# EAGLE design Desktop_Basic (EAGLE 9.4.2)
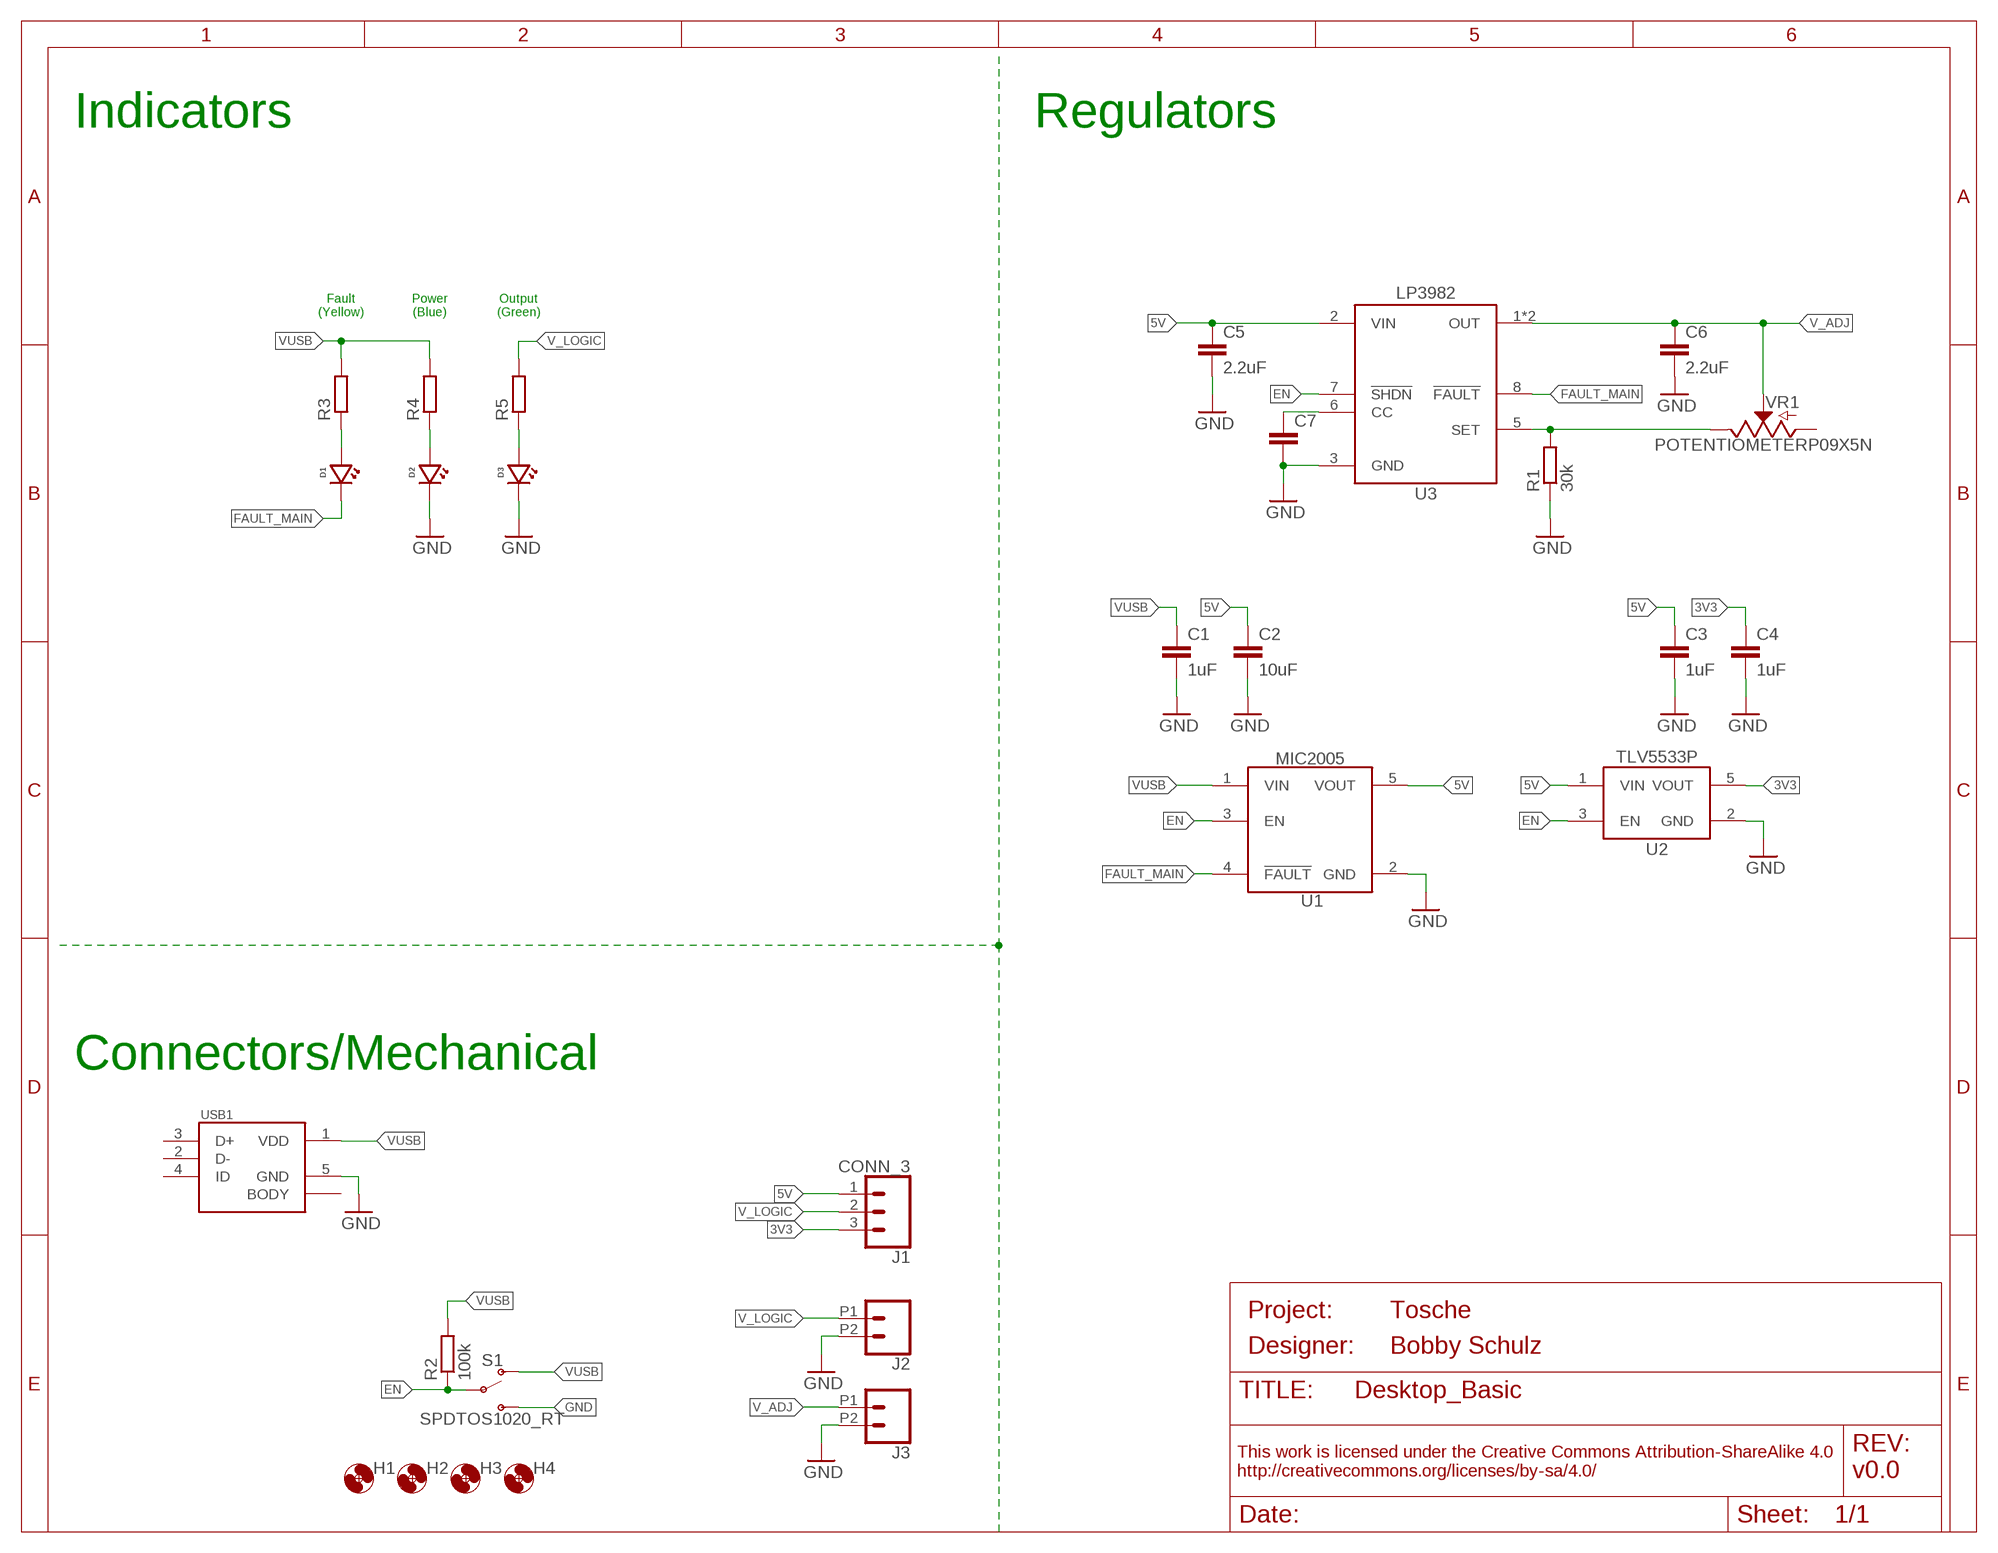
[diagram p0: schematic, sheet 1]
FRAME1 (FRAME_A_L): DESIGNER: Bobby Schulz; PROJECT: Tosche; REV: v0.0

## Parts
C1  1uF  C-EU1UFC0603  [C0603]
C2  10uF  C-EU10UFC0805  [C0805]
C3  1uF  C-EU1UFC0603  [C0603]
C4  1uF  C-EU1UFC0603  [C0603]
C5  2.2uF  C-EU2.2UFC0603  [C0603]
C6  2.2uF  C-EU2.2UFC0603  [C0603]
C7  C-EUC0603  [C0603]
D1  LED0603  [LED_0603]
D2  LEDBLUE0603  [LED_0603]
D3  LEDGREEN0603  [LED_0603]
H1  MOUNTING_HOLE4_PL  [4_40_PLATED]
H2  MOUNTING_HOLE4_PL  [4_40_PLATED]
H3  MOUNTING_HOLE4_PL  [4_40_PLATED]
H4  MOUNTING_HOLE4_PL  [4_40_PLATED]
J1  CONN_3  [1X03]
J2  CONN_022.54_SCREW_ROUND  [1X02_2.54_SCREWTERM_ROUND]
J3  CONN_022.54_SCREW_ROUND  [1X02_2.54_SCREWTERM_ROUND]
R1  30k  R-EU_R0603  [R0603]
R2  100k  R-EU_100KR0603  [R0603]
R3  R-EU_330R0603  [R0603]
R4  R-EU_330R0603  [R0603]
R5  R-EU_330R0603  [R0603]
S1  SPDTOS1020_RT  [OS102011MA1QN1]
U1  MIC2005  [SOT23-5]
U2  TLV755P3V3SOT23  [DBV0005A]
U3  LP3982ADJVSSOP  [DGK_S-PDSO-G8]
USB1  MICRO_USB_LONGPADS  [10118194-0001LF_10118194-0001LF_LONGER_PADS]
VR1  POTENTIOMETERP09X5N  [P0915N]

## Nets
3V3: C4.1 J1.3 U2.5(VOUT)
5V: C2.1 C3.1 C5.1 J1.1 U1.5(VOUT) U2.1(VIN) U3.2(VIN)
EN: R2.1 S1.2(P) U1.3(EN) U2.3(EN) U3.7(!SHDN)
FAULT_MAIN: D1.CATHODE U1.4(!FAULT) U3.8(!FAULT)
GND: C1.2 C2.2 C3.2 C4.2 C5.2 C6.2 C7.2 D2.CATHODE D3.CATHODE J2.P2 J3.P2 R1.1 S1.3(S) U1.2(GND) U2.2(GND) U3.3(GND) USB1.5(GND)
N$1: C7.1 U3.6(CC)
N$2: D1.ANODE R3.1
N$3: R1.2 U3.5(SET) VR1.3(E)
N$4: D2.ANODE R4.1
N$5: D3.ANODE R5.1
V_ADJ: C6.1 J3.P1 U3.1(OUT) U3.4(OUT) VR1.2(S)
V_LOGIC: J1.2 J2.P1 R5.2
VUSB: C1.1 R2.2 R3.2 R4.2 S1.1(O) U1.1(VIN) USB1.1(VDD)
Unconnected: USB1.2(D-) USB1.3(D+) USB1.4(ID) USB1.BODY@1(BODY) USB1.BODY@2(BODY) USB1.BODY@3(BODY) USB1.BODY@4(BODY) USB1.BODY@7(BODY) USB1.BODY@8(BODY) VR1.1(A)

## Notes on the sheet
- Indicators | Regulators
- Fault
  (Yellow)
- Power
  (Blue)
- Output
  (Green)
- Connectors/Mechanical

## Library data of the parts
C1 C3 C4 = bschulz_passives:C-EU: CAPACITOR, European symbol; DIGIKEY: 587-1251-1-ND; MF: Yaiyo Yuden; MPN: EMK107BJ105KA-T
C2 = bschulz_passives:C-EU: CAPACITOR, European symbol; DIGIKEY: 490-6473-6-ND; MF: Murata; MPN: GRM21BR61C106KE15K
C5 C6 = bschulz_passives:C-EU: CAPACITOR, European symbol; DIGIKEY: 1276-1183-1-ND; MF: Samsung; MPN: CL10A225KQ8NNNC
C7 = bschulz_passives:C-EU: CAPACITOR, European symbol
D1 = bschulz:LED: Genaric LED
D2 = bschulz:LED: Genaric LED; DIGIKEY: 732-4966-1-ND; MF: Wurth; MPN: 150060BS75000
D3 = bschulz:LED: Genaric LED; DIGIKEY: 732-4971-1-ND; MF: Wurth; MPN: 150060GS75000
H1-H4 = bschulz:MOUNTING_HOLE: Genaric Mechanical Mounting Hole Hole diameter based on max body diameter + 15% Keepout ring is for diameter of socket cap screw (minimum required clearance) TPlace ring is for diameter of pan head screw (recomended clearance) Specifications: Socket Cap <http://fastener-express.com/fastener-technical/SocketscapSS-Alloy.pdf> Button Head Socket Cap <http://fastener-express.com/fastener-technical/Button-Socket-alloy.pdf> Pan Head <http://fastener-express.com/fastener-technical/pan-machine-Screws.pdf>; DIGIKEY: DNP; MF: N/A; MPN: DNP
J1 = bschulz:CONN_3: Genaric 3 terminal header Digikey 2.54_SCREW <https://www.digikey.com/product-detail/en/on-shore-technology-inc/OSTVN03A150/ED10562-ND/1588863> 3.5_SCREW <https://www.digikey.com/product-detail/en/on-shore-technology-inc/OSTTE030161/ED2636-ND/614585>
J2 J3 = bschulz:CONN_02: Genaric 2 terminal header SCREW_2.54 <https://www.digikey.com/product-detail/en/on-shore-technology-inc/OSTVN02A150/ED10561-ND/1588862> 39532_RA <https://www.digikey.com/product-detail/en/molex/0395321002/WM7845-ND/1280696>; DIGIKEY: ED10561-ND; MF: OnShore; MPN: OSTVN02A150
R1 = bschulz_passives:R-EU_: RESISTOR, European symbol Digikey Parts: Yageo, 0402 <https://www.digikey.com/products/en/resistors/chip-resistor-surface-mount/52?k=&pkeyword=&sv=0&s=4356&sf=1&FV=-1%7C13%2C7%7C2%2C1291%7C39157%2C1989%7C0%2C-8%7C52%2C3%7C1131%2C3%7C2503&quantity=&ColumnSort=0&page=1&stock=1&pageSize=25> Yageo, 0603 <https://www.digikey.com/products/en/resistors/chip-resistor-surface-mount/52?k=&pkeyword=&sv=0&pv1291=39245&sf=1&FV=-5%7C4356%2C-5%7C47360%2C-8%7C52%2C-1%7C13%2C7%7C2%2C1989%7C0&quantity=10&ColumnSort=1000011&page=1&stock=1&pageSize=25> Panasonic, 0603 <https://www.digikey.com/products/en/resistors/chip-resistor-surface-mount/52?k=&pkeyword=&pv252=68&sf=0&FV=ffec373d%2C1c0002%2C142c040c%2C1f140000%2Cffe00034%2C80002%2Cc0001&quantity=&ColumnSort=0&page=1&stock=1&pageSize=25> Panasonic, precision, 0603 <https://www.digikey.com/products/en/resistors/chip-resistor-surface-mount/52?FV=ffec4907%2Cfffc000a%2Cc0172%2C142c040c%2C1f140000%2Cffe00034%2C1c0002&quantity=100&ColumnSort=2085&page=1&stock=1&pageSize=25> Panasonic, 0805 <https://www.digikey.com/products/en/resistors/chip-resistor-surface-mount/52?k=&pkeyword=&pv3=1&sf=0&FV=ffec373d%2C1c0002%2C1f140000%2Cffe00034%2C142c040d&quantity=&ColumnSort=0&page=1&stock=1&pageSize=25> Rohm, current sense <https://www.digikey.com/products/en/resistors/chip-resistor-surface-mount/52?k=&pkeyword=&pv3=1&sf=0&FV=ffecb688%2C1f140000%2Cffe00034%2C1c0002&quantity=&ColumnSort=0&page=1&stock=1&pageSize=25> Vishay, pulse proof automotive <https://www.digikey.com/products/en/resistors/chip-resistor-surface-mount/52?k=&pkeyword=&pv7=2&sf=0&FV=ffec5d6b%2Cffe00034%2C1f140000&quantity=&ColumnSort=0&page=1&stock=1&pageSize=25>; MF: Yageo
R2 = bschulz_passives:R-EU_: RESISTOR, European symbol Digikey Parts: Yageo, 0402 <https://www.digikey.com/products/en/resistors/chip-resistor-surface-mount/52?k=&pkeyword=&sv=0&s=4356&sf=1&FV=-1%7C13%2C7%7C2%2C1291%7C39157%2C1989%7C0%2C-8%7C52%2C3%7C1131%2C3%7C2503&quantity=&ColumnSort=0&page=1&stock=1&pageSize=25> Yageo, 0603 <https://www.digikey.com/products/en/resistors/chip-resistor-surface-mount/52?k=&pkeyword=&sv=0&pv1291=39245&sf=1&FV=-5%7C4356%2C-5%7C47360%2C-8%7C52%2C-1%7C13%2C7%7C2%2C1989%7C0&quantity=10&ColumnSort=1000011&page=1&stock=1&pageSize=25> Panasonic, 0603 <https://www.digikey.com/products/en/resistors/chip-resistor-surface-mount/52?k=&pkeyword=&pv252=68&sf=0&FV=ffec373d%2C1c0002%2C142c040c%2C1f140000%2Cffe00034%2C80002%2Cc0001&quantity=&ColumnSort=0&page=1&stock=1&pageSize=25> Panasonic, precision, 0603 <https://www.digikey.com/products/en/resistors/chip-resistor-surface-mount/52?FV=ffec4907%2Cfffc000a%2Cc0172%2C142c040c%2C1f140000%2Cffe00034%2C1c0002&quantity=100&ColumnSort=2085&page=1&stock=1&pageSize=25> Panasonic, 0805 <https://www.digikey.com/products/en/resistors/chip-resistor-surface-mount/52?k=&pkeyword=&pv3=1&sf=0&FV=ffec373d%2C1c0002%2C1f140000%2Cffe00034%2C142c040d&quantity=&ColumnSort=0&page=1&stock=1&pageSize=25> Rohm, current sense <https://www.digikey.com/products/en/resistors/chip-resistor-surface-mount/52?k=&pkeyword=&pv3=1&sf=0&FV=ffecb688%2C1f140000%2Cffe00034%2C1c0002&quantity=&ColumnSort=0&page=1&stock=1&pageSize=25> Vishay, pulse proof automotive <https://www.digikey.com/products/en/resistors/chip-resistor-surface-mount/52?k=&pkeyword=&pv7=2&sf=0&FV=ffec5d6b%2Cffe00034%2C1f140000&quantity=&ColumnSort=0&page=1&stock=1&pageSize=25>; DIGIKEY: 311-100KHRCT-ND; MF: Yageo; MPN: RC0603FR-07100KL; VALUE_PART: 100k
R3-R5 = bschulz_passives:R-EU_: RESISTOR, European symbol Digikey Parts: Yageo, 0402 <https://www.digikey.com/products/en/resistors/chip-resistor-surface-mount/52?k=&pkeyword=&sv=0&s=4356&sf=1&FV=-1%7C13%2C7%7C2%2C1291%7C39157%2C1989%7C0%2C-8%7C52%2C3%7C1131%2C3%7C2503&quantity=&ColumnSort=0&page=1&stock=1&pageSize=25> Yageo, 0603 <https://www.digikey.com/products/en/resistors/chip-resistor-surface-mount/52?k=&pkeyword=&sv=0&pv1291=39245&sf=1&FV=-5%7C4356%2C-5%7C47360%2C-8%7C52%2C-1%7C13%2C7%7C2%2C1989%7C0&quantity=10&ColumnSort=1000011&page=1&stock=1&pageSize=25> Panasonic, 0603 <https://www.digikey.com/products/en/resistors/chip-resistor-surface-mount/52?k=&pkeyword=&pv252=68&sf=0&FV=ffec373d%2C1c0002%2C142c040c%2C1f140000%2Cffe00034%2C80002%2Cc0001&quantity=&ColumnSort=0&page=1&stock=1&pageSize=25> Panasonic, precision, 0603 <https://www.digikey.com/products/en/resistors/chip-resistor-surface-mount/52?FV=ffec4907%2Cfffc000a%2Cc0172%2C142c040c%2C1f140000%2Cffe00034%2C1c0002&quantity=100&ColumnSort=2085&page=1&stock=1&pageSize=25> Panasonic, 0805 <https://www.digikey.com/products/en/resistors/chip-resistor-surface-mount/52?k=&pkeyword=&pv3=1&sf=0&FV=ffec373d%2C1c0002%2C1f140000%2Cffe00034%2C142c040d&quantity=&ColumnSort=0&page=1&stock=1&pageSize=25> Rohm, current sense <https://www.digikey.com/products/en/resistors/chip-resistor-surface-mount/52?k=&pkeyword=&pv3=1&sf=0&FV=ffecb688%2C1f140000%2Cffe00034%2C1c0002&quantity=&ColumnSort=0&page=1&stock=1&pageSize=25> Vishay, pulse proof automotive <https://www.digikey.com/products/en/resistors/chip-resistor-surface-mount/52?k=&pkeyword=&pv7=2&sf=0&FV=ffec5d6b%2Cffe00034%2C1f140000&quantity=&ColumnSort=0&page=1&stock=1&pageSize=25>; DIGIKEY: 311-330HRCT-ND; MF: Yageo; MPN: RC0603FR-07330RL; VALUE_PART: 330
S1 = bschulz:SPDT: Genaric SPDT switch; DIGIKEY: CKN9559-ND; MF: C&K; MPN: OS102011MA1QN1
U1 = bschulz:MIC2005: MIC2005 - Hight Side Load Switch, with Fixed Current Limit Characteristics: Vin: 2.5v ~ 5.5v IQ: 1μA (OFF), 80μA (ON) RDS(ON): 170mΩ (Vin = 5v) UVLO: 2.25V Output Current: 500/800/1200mA Operating Temperature: -40°C to 85°C Digikey: MIC2005A-1 <https://www.digikey.com/product-detail/en/microchip-technology/MIC2005A-1YM5-TR/576-3462-1-ND/2062462>; DIGIKEY: 576-3462-1-ND; DISP: MIC2005; MF: Microchip; MPN: MIC2005A-1YM5-TR
U2 = bschulz:TLV755P: TLV755xx(x)P - Low IQ, Small Size, Low Dropout, Positive Voltage Regulator Characteristics: Vin: 1.45V ~ 5.5V Vout: Many, fixed IQ: 25μA (typ) Output Current: 500 mA Dropout Voltage: 238mV @ 500mA Operating Temperature: -40°C to 85°C Digikey: TLV75533PDBVR (3v3, SOT-23) <https://www.digikey.com/product-detail/en/texas-instruments/TLV75533PDBVR/296-50411-1-ND/9685550>; DIGIKEY: 296-50411-1-ND; DISP: TLV5533P; MF: TI; MPN: TLV75533PDBVR
U3 = bschulz:LP3982: LP3982* - Micropower, Ultra-Low-Dropout, Low-Noise, Linear Regulator Characteristics: Vin: 2.5V ~ 6V Vout: 1.8V, 2.5V, 3.3V, ADJ IQ: 90μA typ Dropout Voltage: 120mV @ 300mA Voltage Accuracy: 2% typ, 3.5% max Output Current: 300 mA Operating Temperature: -40°C to 85°C Features: Fault, Enable Digikey: LP3982IMM-ADJ/NOPB (Adjustable, VSSOP) <https://www.digikey.com/product-detail/en/texas-instruments/LP3982IMM-ADJ-NOPB/LP3982IMM-ADJ-NOPBCT-ND/570193>; DIGIKEY: LP3982IMM-ADJ/NOPBCT-ND; MF: TI; MPN: LP3982IMM-ADJ/NOPB
USB1 = bschulz:MICRO_USB_LONGPADS; DIGIKEY: 609-4618-1-ND; MF: Amphenol; MPN: 10118194-0001LF
VR1 = bschulz:POTENTIOMETER: Genaric potentiometer

## Board
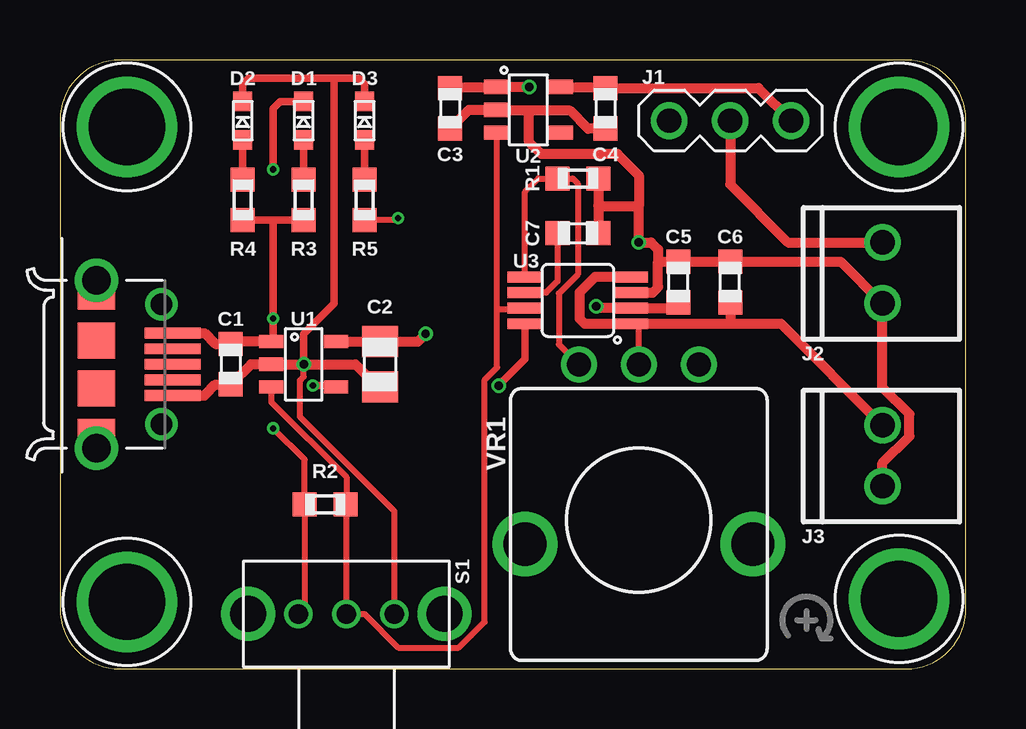
[diagram p1: board, top side]
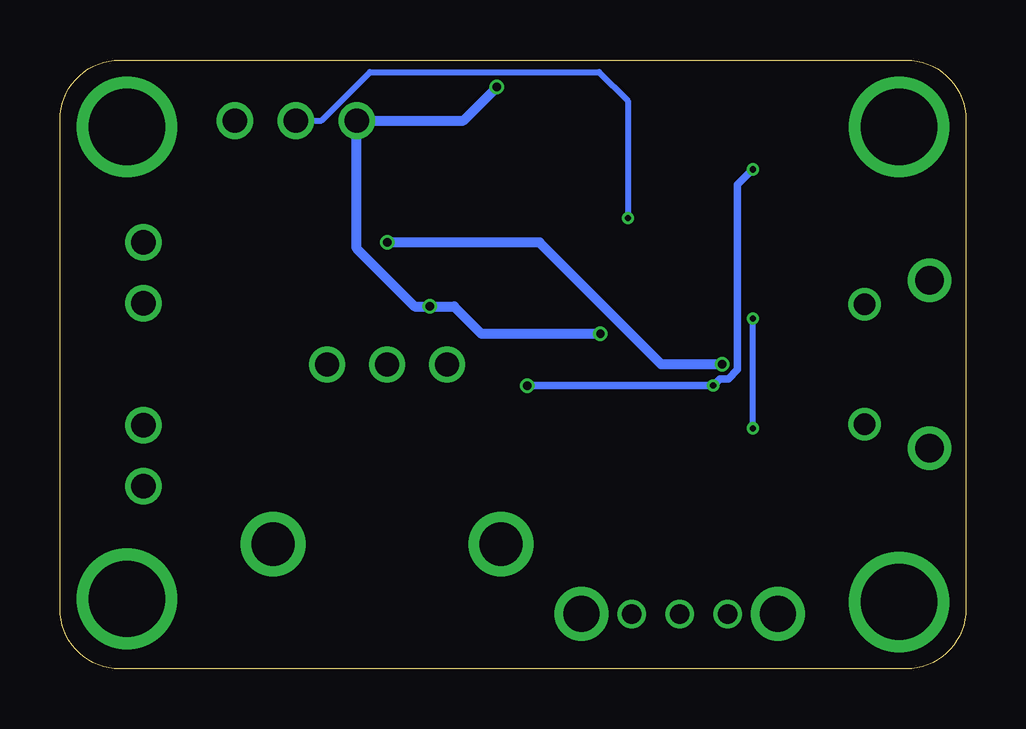
[diagram p2: board, bottom side, seen from below]

Size 37.77 x 25.39 mm. Coordinates in mm from the lower left corner, seen from the top.
Outline: 0,22.89 0,2.5 arc90 2.5,0 35.27,0 arc90 37.77,2.5 37.77,22.89 arc90 35.27,25.39 2.5,25.39 arc90 0,22.89
Copper layers (1*16): Top 0.035559375mm / dielectric 1.6mm / Bottom 0.035559375mm
Design rules "oshpark-2layer": minimum track width 6mil, minimum drill 10mil, track to track 6mil, track to pad 6mil, pad to pad 6mil, via to via 6mil, smd to smd 6mil, copper to edge 15mil, drill to drill 6mil, minimum pad ring 5mil, minimum via ring 5mil, stop-mask expansion 2.5mil, vias tented up to drill 0mil, thermal gap 10mil

### Footprints (pad centres in the part's own frame; a part is rotated, then mirrored left to right if it is on the bottom)
C0603 = smd 1 x 1: 1 -0.85,0; 2 0.85,0
C0805 = smd 1.3 x 1.5: 1 -0.95,0; 2 0.95,0
LED_0603 = smd 0.8 x 0.8: ANODE 0.8,0; CATHODE -0.8,0
4_40_PLATED = drill 3.175: P$1 0,0
1X03 = drill 1.016: 1 -2.54,0; 2 0,0; 3 2.54,0
1X02_2.54_SCREWTERM_ROUND = drill 1.016: P1 1.27,0; P2 -1.27,0
R0603 = smd 1 x 1: 1 -0.85,0; 2 0.85,0
OS102011MA1QN1 = drill 0.8: 1 -2,0; 2 0,0; 3 2,0 | drill 1.5: BODY@1 -4.1,0; BODY@2 4.1,0
SOT23-5 = smd 0.55 x 1: 1 -0.95,-1.35; 2 0,-1.35; 3 0.95,-1.35; 4 0.95,1.35; 5 -0.95,1.35
DBV0005A = smd 1.1 x 0.6: 1 -1.3,0.95; 2 -1.3,0; 3 -1.3,-0.95; 4 1.3,-0.95; 5 1.3,0.95
DGK_S-PDSO-G8 = smd 1.45 x 0.45: 1 -2.2,0.975; 2 -2.2,0.325; 3 -2.2,-0.325; 4 -2.2,-0.975; 5 2.2,-0.975; 6 2.2,-0.325; 7 2.2,0.325; 8 2.2,0.975
10118194-0001LF_10118194-0001LF_LONGER_PADS = smd 0.45 x 2.35: 1 -1.3,3.175; 2 -0.65,3.175; 3 0,3.175; 4 0.65,3.175; 5 1.3,3.175 | drill 0.9: BBODY@1 -2.5,2.7; BBODY@2 2.5,2.7 | drill 1.2: BODY@1 -3.5,0; BODY@4 3.5,0 | smd 1.5 x 1.55: BODY@2 -1,0; BODY@3 1,0; BODY@7 -3.032,0; BODY@8 3.032,0
P0915N = drill 1: 1 -2.5,0; 2 0,0; 3 2.5,0 | drill 1.8: BODY@1 -4.75,7.5; BODY@2 4.75,7.5

### Placement (x,y rotation side)
C1  7.11,12.7 270 top
C2  13.34,12.7 270 top
C3  16.26,23.37 270 top
C4  22.73,23.37 270 top
C5  25.78,16.13 90 top
C6  27.94,16.13 90 top
C7  21.59,18.16 0 top
D1  10.16,22.86 270 top
D2  7.62,22.86 270 top
D3  12.7,22.86 270 top
H1  2.79,22.6 0 top
H2  2.79,2.79 0 top
H3  34.98,22.6 0 top
H4  34.98,2.92 0 top
J1  27.94,22.86 0 top
J2  34.29,16.51 90 top
J3  34.29,8.89 90 top
R1  21.59,20.45 180 top
R2  11.05,6.86 180 top
R3  10.16,19.56 270 top
R4  7.62,19.56 270 top
R5  12.7,19.56 270 top
S1  11.94,2.29 0 top
U1  10.16,12.7 270 top
U2  19.53,23.31 0 top
U3  21.59,15.37 180 top
USB1  1.52,12.7 270 top
VR1  24.13,12.7 180 top

### Tracks (layer width: path | path; a pad name or v marks a point on that pad's centre or on a via)
3V3
  Top 0.406: U2.5 22.69,24.26 C4.1 29.12,24.22 J1.3
5V  (via drill 0.35)
  Top 0.406: C5.1 25.54,15.04 U3.2 22.42,15.04 v22.35,15.11 | U1.5 C2.1 14.92,13.65 v15.24,13.97 | C3.1 16.3,24.26 U2.1 v19.56,24.26
  Bottom 0.406: v15.24,13.97 20.19,13.97 21.34,15.11 v22.35,15.11 22.99,15.11 25.4,17.53 J1.1 20.95,22.86 v19.56,24.26
EN
  Top 0.254: 11.94,6.82 S1.2 12.69,2.29 14.1,0.88 16.62,0.88 17.14,1.4 17.71,1.96 17.71,12.05 18.23,12.57 18.23,14.99 | 11.94,6.82 R2.1 | 18.23,14.99 U2.3 | U3.7 19.33,14.99 18.23,14.99 | 11.94,6.82 11.94,8 8.81,11.13 U1.3
FAULT_MAIN  (via drill 0.25, 0.35)
  Top 0.305: U3.8 19.39,12.91 v18.29,11.81 | v10.54,11.81 11.45,11.81 U1.4 | v8.89,20.83 8.89,23.37 9.18,23.66 D1.CATHODE
  Bottom 0.305: v18.29,11.81 v10.54,11.81 10.26,12.09 9.91,12.09 9.53,12.48 9.53,20.19 v8.89,20.83
GND  (via drill 0.35)
  Top 0.254: S1.3 13.94,6.58 10.01,10.51 10.01,12.03 10.16,12.18 v10.16,12.7
  Top 0.305: D2.CATHODE 7.62,24.38 7.87,24.64 11.43,24.64 | 11.43,24.64 12.45,24.64 12.7,24.38 D3.CATHODE | 11.43,24.64 11.43,15.24 10.16,13.97 v10.16,12.7
  Top 0.406: USB1.5 6.03,11.4 6.48,11.85 C1.2 7.96,12.7 U1.2 v10.16,12.7 12.32,12.7 13.27,11.75 C2.2 | 24.93,16.98 C5.2 C6.2 32.55,16.98 J2.P2 34.29,11.74 35.41,10.62 35.41,9.7 34.29,8.58 J3.P2 | U3.3 24.71,15.69 24.93,15.91 24.93,15.93 24.93,16.98 | C4.2 22.02,22.52 21.27,23.27 19.56,23.27 | 19.56,23.27 18.27,23.27 U2.2 17.05,23.31 C3.2 | 24.13,19.3 v24.13,17.78 24.64,17.78 24.93,17.49 24.93,16.98 | 24.13,19.3 24.13,20.57 23.24,21.46 20.07,21.46 19.56,21.97 19.56,23.27 | R1.1 22.44,19.3 | 22.44,19.3 C7.2 | 22.44,19.3 24.13,19.3
  Bottom 0.406: v10.16,12.7 12.7,12.7 17.78,17.78 v24.13,17.78
N$1
  Top 0.254: C7.1 20.74,16.17 20.26,15.69 U3.6
N$2
  Top 0.305: D1.ANODE R3.1
N$3
  Top 0.254: U3.5 19.39,19.9 19.94,20.45 R1.2 21.38,20.45 21.59,20.23 21.59,16.44 20.8,15.65 20.8,13.53 VR1.3
N$4
  Top 0.305: D2.ANODE R4.1
N$5
  Top 0.305: D3.ANODE R5.1
V_ADJ
  Top 0.254: VR1.2 24.13,14.39
  Top 0.406: U3.4 22.31,16.34 21.66,15.69 21.66,14.61 21.87,14.39 U3.1 24.13,14.39 27.81,14.39 | J3.P1 30.06,14.39 27.81,14.39 | C6.1 27.94,14.52 27.81,14.39
V_LOGIC  (via drill 0.25)
  Top 0.254: v14.1,18.8 14.01,18.71 R5.2
  Top 0.406: J1.2 27.94,20.19 30.35,17.78 J2.P1
  Bottom 0.254: J1.2 26.87,22.86 24.85,24.88 15.3,24.88 14.1,23.68 v14.1,18.8
VUSB  (via drill 0.25)
  Top 0.254: S1.1 10.2,2.55 R2.2 10.2,8.72 v8.89,10.03
  Top 0.305: R4.2 8.89,18.71 | 8.89,18.71 R3.2 | U1.1 8.89,13.65 v8.89,14.61 8.89,18.71
  Top 0.406: USB1.1 6.03,14 6.48,13.55 C1.1 7.21,13.65 U1.1
  Bottom 0.254: v8.89,10.03 v8.89,14.61

### Text on the board
tDocu: PWR | FAULT | OUTPUT | 5V | 3V3 | VCC | GND | ADJ | GND | USB1 | Tosche / Desktop / Basic | ON | OFF
bDocu: 3V3/5V | 0 ~ 5V | Project-Tosche / Desktop-Basic / Bobby Schulz / v0.0